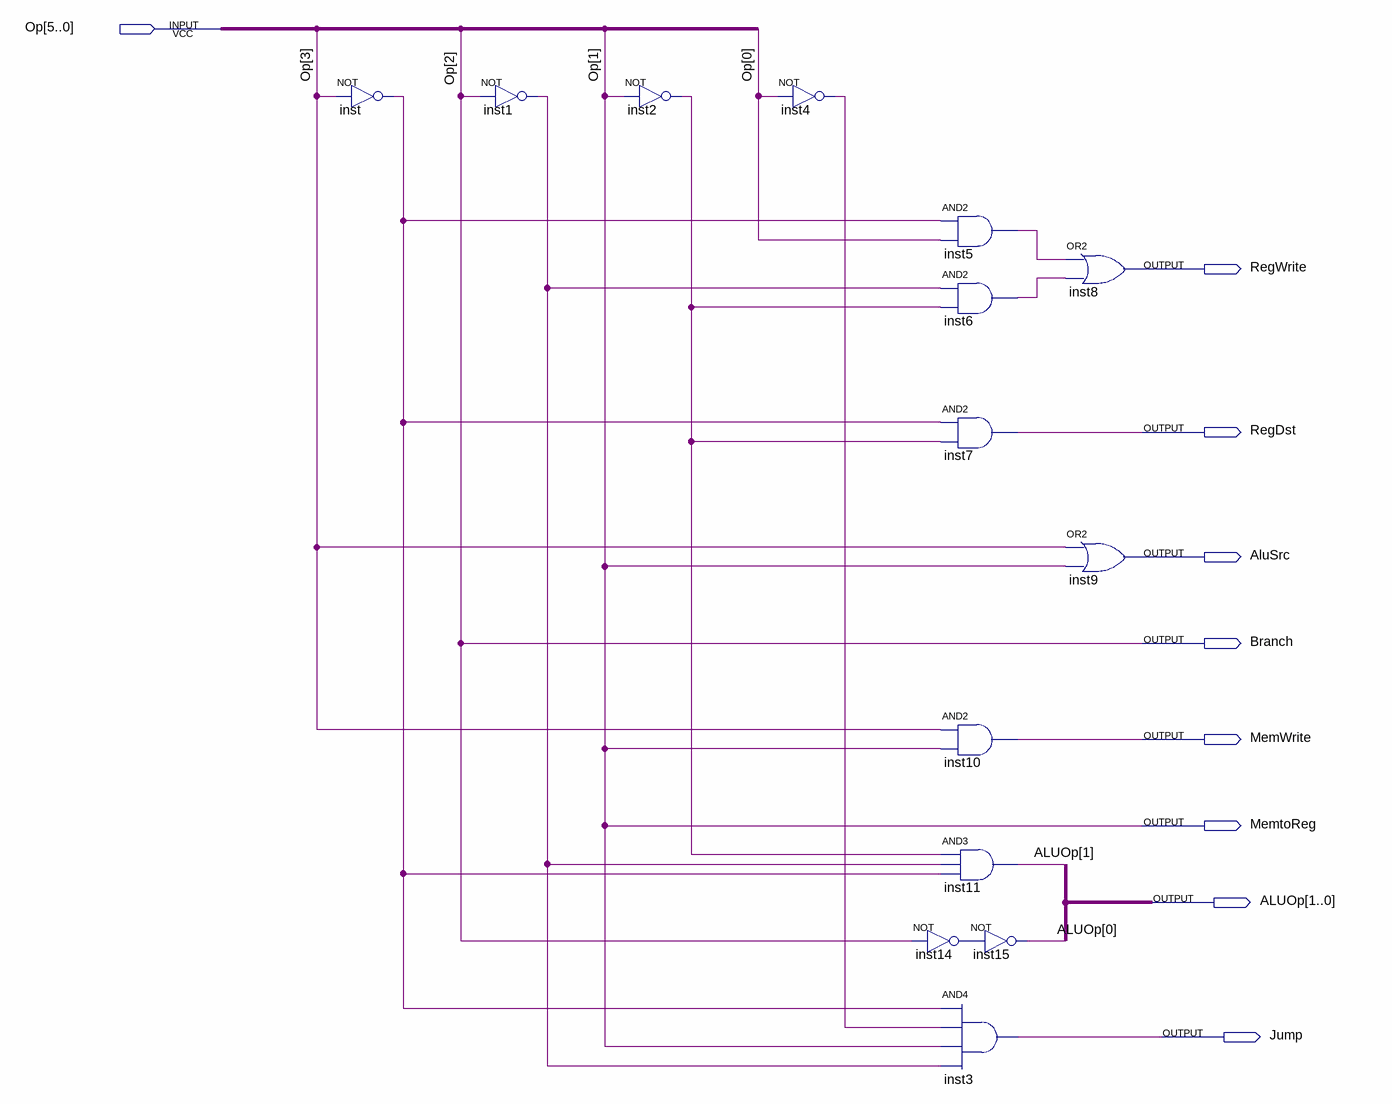
[diagram p0: schematic sheet]
// Quartus schematic maindecoder.bdf as structural Verilog: 14 symbols, 9 pins
module maindecoder (
  input  [5:0] Op,
  output RegWrite,
  output RegDst,
  output AluSrc,
  output Branch,
  output MemWrite,
  output MemtoReg,
  output [1:0] ALUOp,
  output Jump
);

  wire inst1_out, inst2_out, inst4_out, inst5_out, inst6_out, inst14_out, inst_out;

  not inst (inst_out, Op[3]);
  not inst1 (inst1_out, Op[2]);
  not inst2 (inst2_out, Op[1]);
  not inst4 (inst4_out, Op[0]);
  not inst14 (inst14_out, Op[2]);
  and inst5 (inst5_out, inst_out, Op[0]);
  and inst6 (inst6_out, inst1_out, inst2_out);
  and inst7 (RegDst, inst_out, inst2_out);
  and inst10 (MemWrite, Op[3], Op[1]);
  and inst11 (ALUOp[1], inst2_out, inst1_out, inst_out);
  not inst15 (ALUOp[0], inst14_out);
  and inst3 (Jump, inst_out, inst4_out, Op[1], inst1_out);
  or inst8 (RegWrite, inst5_out, inst6_out);
  or inst9 (AluSrc, Op[3], Op[1]);

  assign Branch = Op[2];
  assign MemtoReg = Op[1];
endmodule
